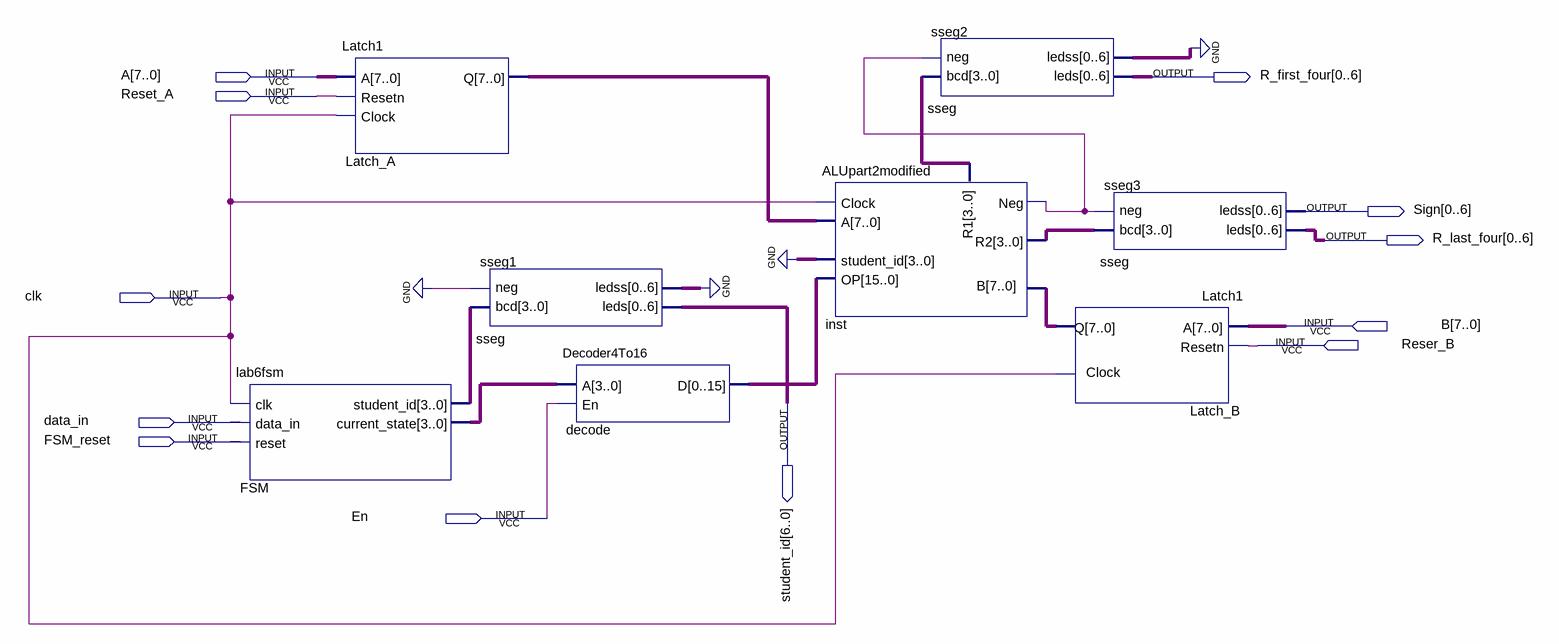
[diagram p0: schematic sheet]
// Quartus schematic ALUProblem2.bdf as structural Verilog: 8 symbols, 12 pins
module ALUProblem2 (
  input  [7:0] A,
  input  Reset_A,
  input  clk,
  input  [7:0] B,
  input  Reser_B,
  input  data_in,
  input  FSM_reset,
  input  En,
  output [0:6] R_first_four,
  output [0:6] Sign,
  output [0:6] R_last_four,
  output [6:0] student_id
);

  wire inst_neg;
  wire [3:0] FSM_current_state, FSM_student_id, inst_r1, inst_r2;
  wire [6:0] sseg1_ledss, sseg2_ledss;
  wire [7:0] Latch_A_q, Latch_B_q;
  wire [15:0] decode_d;

  lab6fsm FSM (
    .clk(clk), .data_in(data_in), .reset(FSM_reset), .student_id(FSM_student_id),
    .current_state(FSM_current_state));
  Latch1 Latch_A (.A(A), .Resetn(Reset_A), .Clock(clk), .Q(Latch_A_q));
  sseg sseg1 (.bcd(FSM_student_id), .neg(1'b0), .leds(student_id), .ledss(sseg1_ledss));
  Decoder4To16 decode (.A(FSM_current_state), .En(En), .D(decode_d));
  ALUpart2modified inst (
    .Clock(clk), .A(Latch_A_q), .B(Latch_B_q), .student_id(4'b0000), .OP(decode_d), .Neg(inst_neg),
    .R1(inst_r1), .R2(inst_r2));
  sseg sseg2 (.bcd(inst_r1), .neg(inst_neg), .leds(R_first_four), .ledss(sseg2_ledss));
  Latch1 Latch_B (.A(B), .Resetn(Reser_B), .Clock(clk), .Q(Latch_B_q));
  sseg sseg3 (.bcd(inst_r2), .neg(inst_neg), .leds(R_last_four), .ledss(Sign));
  // also tied to GND on the sheet: {sseg1_ledss[0], sseg1_ledss[1], sseg1_ledss[2], sseg1_ledss[3], sseg1_ledss[4], sseg1_ledss[5], sseg1_ledss[6], sseg2_ledss[0], sseg2_ledss[1], sseg2_ledss[2], sseg2_ledss[3], sseg2_ledss[4], sseg2_ledss[5], sseg2_ledss[6]}
endmodule
